# Altium schematic sheet Periph.SchDoc
size A; SheetNumber: 5; SheetTotal: 6
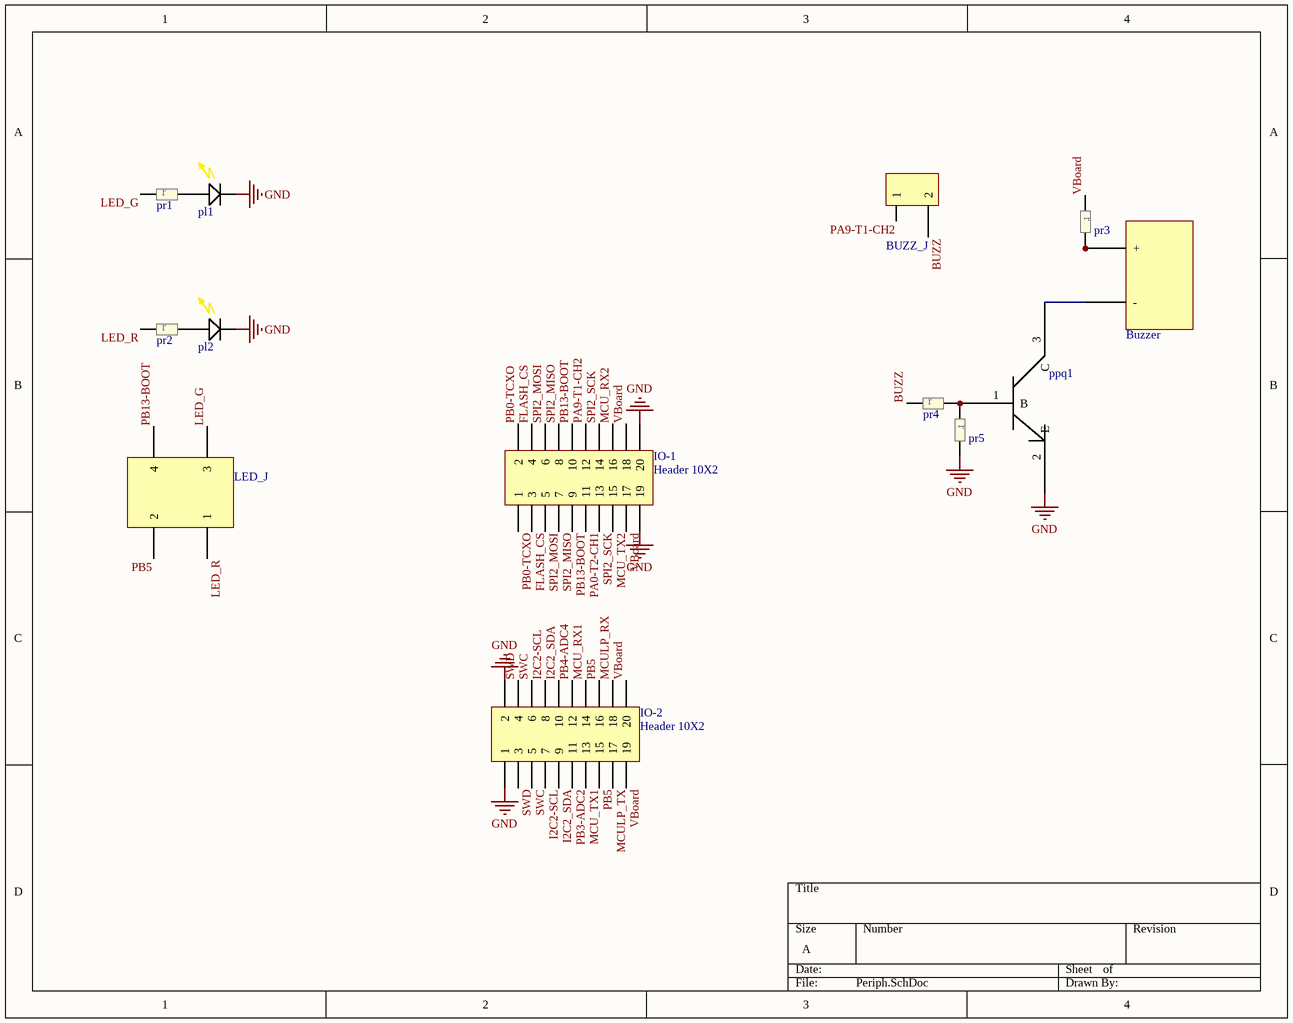
[diagram p0: Periph.SchDoc]

## Parts
BUZZ_J  pin header 2mm  [abr_ph_2x1_2mm_3d_male]  (value not drawn)
Buzzer  LED  [ABR_BUZZER_9MM_3D]  (value not drawn)
IO-1  Header 10X2  [HDR2X10]
IO-2  Header 10X2  [HDR2X10]
LED_J  pin header 2mm  [abr_ph_2x2_2mm_3d_male]  (value not drawn)
pl1  smd-0805  [abr_led_g_0805_3d]  (value not drawn)
pl2  smd-0805  [abr_led_r_0805_3d]  (value not drawn)
ppq1  transistor  [abr_fp_sot-23_3d]  (value not drawn)
pr1  2.2K  [abr_res_0805_3d]  (value not drawn)
pr2  2.2K  [abr_res_0805_3d]  (value not drawn)
pr3  2.2K  [abr_res_0805_3d]  (value not drawn)
pr4  2.2K  [abr_res_0805_3d]  (value not drawn)
pr5  2.2K  [abr_res_0805_3d]  (value not drawn)

## Nets
GND: IO-1.19 IO-1.20 IO-2.1 IO-2.2 pl1.1 pl2.1 ppq1.2(E) pr5.1
BUZZ: BUZZ_J.2 pr4.0
FLASH_CS: IO-1.3 IO-1.4
I2C2-SCL: IO-2.7 IO-2.8
I2C2_SDA: IO-2.9 IO-2.10
LED_G: LED_J.3 pr1.0
LED_R: LED_J.1 pr2.0
MCU_RX1: IO-2.14
MCU_RX2: IO-1.16
MCU_TX1: IO-2.13
MCU_TX2: IO-1.15
MCULP_RX: IO-2.18
MCULP_TX: IO-2.17
PA0-T2-CH1: IO-1.11
PA9-T1-CH2: BUZZ_J.1 IO-1.12
PB0-TCXO: IO-1.1 IO-1.2
PB3-ADC2: IO-2.11
PB4-ADC4: IO-2.12
PB5: IO-2.15 IO-2.16 LED_J.2
PB13-BOOT: IO-1.9 IO-1.10 LED_J.4
SPI2_MISO: IO-1.7 IO-1.8
SPI2_MOSI: IO-1.5 IO-1.6
SPI2_SCK: IO-1.13 IO-1.14
SWC: IO-2.5 IO-2.6
SWD: IO-2.3 IO-2.4
VBoard: IO-1.17 IO-1.18 IO-2.19 IO-2.20 pr3.0
NetBuzzer_1: Buzzer.1(+) pr3.1
NetBuzzer_2: Buzzer.2(-) ppq1.3(C)
Netpl1_0: pl1.0 pr1.1
Netpl2_0: pl2.0 pr2.1
Netppq1_1: ppq1.1(B) pr4.1 pr5.0

## Notes on the sheet
- (in symbol abr_res_0805) r

## Library data of the parts
BUZZ_J = abr_2x1_2mm
Buzzer = abr_buzzer
IO-1 IO-2 = Header 10X2: Header, 10-Pin, Dual row; LatestRevisionDate: 17-Jul-2002; LatestRevisionNote: Re-released for DXP Platform.; Publisher: Altium Limited
LED_J = abr_2x2_2mm
pl1 pl2 = abr_led_0805
ppq1 = abr_bc847
pr1-pr5 = abr_res_0805